# EAGLE design pcm2912a (EAGLE 7.6.0)
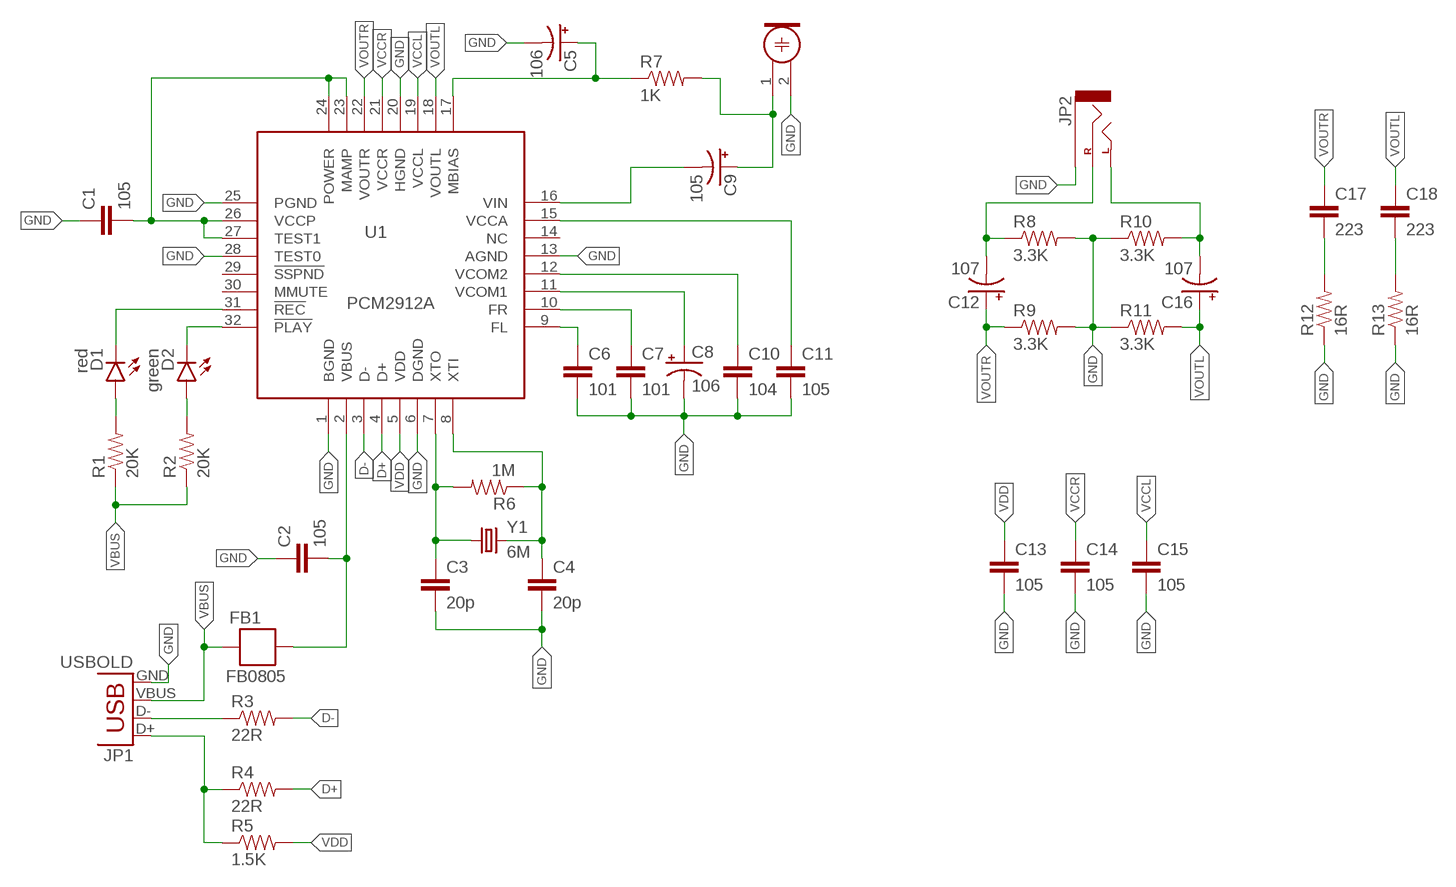
[diagram p0: schematic, sheet 1]

## Parts
C1  105  CAP0402-CAP  [0402-CAP]
C2  105  CAP0402-CAP  [0402-CAP]
C3  20p  CAP0402-CAP  [0402-CAP]
C4  20p  CAP0402-CAP  [0402-CAP]
C5  106  CAP_POL1206-KIT  [EIA3216-KIT]
C6  101  CAP0402-CAP  [0402-CAP]
C7  101  CAP0402-CAP  [0402-CAP]
C8  106  CAP_POL1206-KIT  [EIA3216-KIT]
C9  105  CAP_POL1206-KIT  [EIA3216-KIT]
C10  104  CAP0402-CAP  [0402-CAP]
C11  105  CAP0402-CAP  [0402-CAP]
C12  107  CAP_POL3528-KIT  [EIA3528-KIT]
C13  105  CAP0402-CAP  [0402-CAP]
C14  105  CAP0402-CAP  [0402-CAP]
C15  105  CAP0402-CAP  [0402-CAP]
C16  107  CAP_POL3528-KIT  [EIA3528-KIT]
C17  223  CAP0402-CAP  [0402-CAP]
C18  223  CAP0402-CAP  [0402-CAP]
D1  red  LED-EASY  [LED-0603-EASY]
D2  green  LED-EASY  [LED-0603-EASY]
FB1  FB0805  [0805]
JP1  USBOLD  [USB-MINIB-OLD]
JP2  AUDIO-JACKAUDIO-JACK-3.5MM-PTH-JLC  [AUDIO-JACK-3.5MM-PTH-JLC]
M1  ELECTRET_MICROPHON-WM-62PC/62PK  [WM-62PC/62PK]
R1  20K  RESISTOR0402  [0402-RES]
R2  20K  RESISTOR0402  [0402-RES]
R3  22R  RESISTOR0402  [0402-RES]
R4  22R  RESISTOR0402  [0402-RES]
R5  1.5K  RESISTOR0402  [0402-RES]
R6  1M  RESISTOR0402  [0402-RES]
R7  1K  RESISTOR0402  [0402-RES]
R8  3.3K  RESISTOR0402  [0402-RES]
R9  3.3K  RESISTOR0402  [0402-RES]
R10  3.3K  RESISTOR0402  [0402-RES]
R11  3.3K  RESISTOR0402  [0402-RES]
R12  16R  RESISTOR0402  [0402-RES]
R13  16R  RESISTOR0402  [0402-RES]
U1  PCM2912A  [TQFP32-08]
Y1  6M  CRYSTALHC49US  [HC49US]

## Nets
D+: R4.2 U1.4(D+)
D-: R3.2 U1.3(D-)
GND: C1.1 C2.1 C3.2 C4.2 C5.C(-) C6.2 C7.2 C8.C(-) C10.2 C11.2 C13.2 C14.2 C15.2 JP1.GND JP2.P$1(SLEEVE) M1.2 R8.2 R9.2 R10.1 R11.1 R12.1 R13.1 U1.1(BGND) U1.6(DGND) U1.13(AGND) U1.20(HGND) U1.25(PGND) U1.28(TEST0)
N$1: C6.1 U1.9(FL)
N$2: C7.1 U1.10(FR)
N$3: C8.A(+) U1.11(VCOM1)
N$4: C10.1 U1.12(VCOM2)
N$5: C11.1 U1.15(VCCA)
N$6: D1.-(C) U1.31(!REC)
N$7: D2.-(C) U1.32(!PLAY)
N$8: D1.+(A) R1.2
N$9: D2.+(A) R2.2
N$10: C3.1 R6.2 U1.7(XTO) Y1.1
N$11: C4.1 R6.1 U1.8(XTI) Y1.2
N$12: JP1.D- R3.1
N$13: JP1.D+ R4.1 R5.1
N$14: C9.C(-) U1.16(VIN)
N$15: C2.2 FB1.1 U1.2(VBUS)
N$16: C12.C(-) JP2.P$2(RIGHT) R8.1
N$17: C1.2 U1.23(MAMP) U1.24(POWER) U1.26(VCCP) U1.27(TEST1)
N$18: C9.A(+) M1.1 R7.2
N$19: C5.A(+) R7.1 U1.17(MBIAS)
N$21: C16.C(-) JP2.P$3(LEFT) R10.2
N$22: C17.2 R12.2
N$24: C18.2 R13.2
VBUS: FB1.2 JP1.VBUS R1.1 R2.1
VCCL: C15.1 U1.19(VCCL)
VCCR: C14.1 U1.21(VCCR)
VDD: C13.1 R5.2 U1.5(VDD)
VOUTL: C16.A(+) C18.1 R11.2 U1.18(VOUTL)
VOUTR: C12.A(+) C17.1 R9.1 U1.22(VOUTR)
Unconnected: U1.14(NC) U1.29(!SSPND) U1.30(MMUTE)

## Library data of the parts
C1-C4 C6 C7 C10 C11 C13-C15 C17 C18 = z_jlc_smt:CAP: Capacitor Standard 0603 ceramic capacitor, and 0.1" leaded capacitor.
C5 C8 C9 C12 C16 = z_jlc_smt:CAP_POL: Capacitor Polarized These are standard SMD and PTH capacitors. Normally 10uF, 47uF, and 100uF in electrolytic and tantalum varieties. Always verify the external diameter of the through hole cap, it varies with capacity, voltage, and manufacturer. The EIA devices should be standard.
D1 D2 = z_jlc_smt:LED: LEDs Standard schematic elements and footprints for 5mm, 3mm, 1206, and 0603 sized LEDs. 5mm - Spark Fun Electronics SKU : COM-00529 (and others)
FB1 = xmgu2008:FB
JP1 = xmgu2008:USB: USB Connectors USB-B-PTH is fully proven SKU : PRT-00139/CONN-08278 USB-miniB is fully proven SKU : PRT-00587 USB-A-PCB is untested. USB-A-H is throughly reviewed, but untested. Spark Fun Electronics SKU : PRT-00437 USB-B-SMT is throughly reviewed, but untested. Needs silkscreen touching up. USB-A-S has not been used/tested USB-MB-H has not been used/tested USB-MICROB has been used. CONN-09505
JP2 = xmgu2008:AUDIO-JACK: 3.5mm Audio Jack Simple 3.5mm common PCB mount audio jack. Variant PTH is our storefront SKU PRT-08032
M1 = xmgu2008:ELECTRET_MICROPHON-: Electret Condenser Microphone
R1-R13 = z_jlc_smt:RESISTOR: Resistor Basic schematic elements and footprints for 0603, 1206, and PTH resistors.
U1 = xmgu2008:PCM2912A
Y1 = xmgu2008:CRYSTAL: Various standard crystals. Proven footprints.

## Board
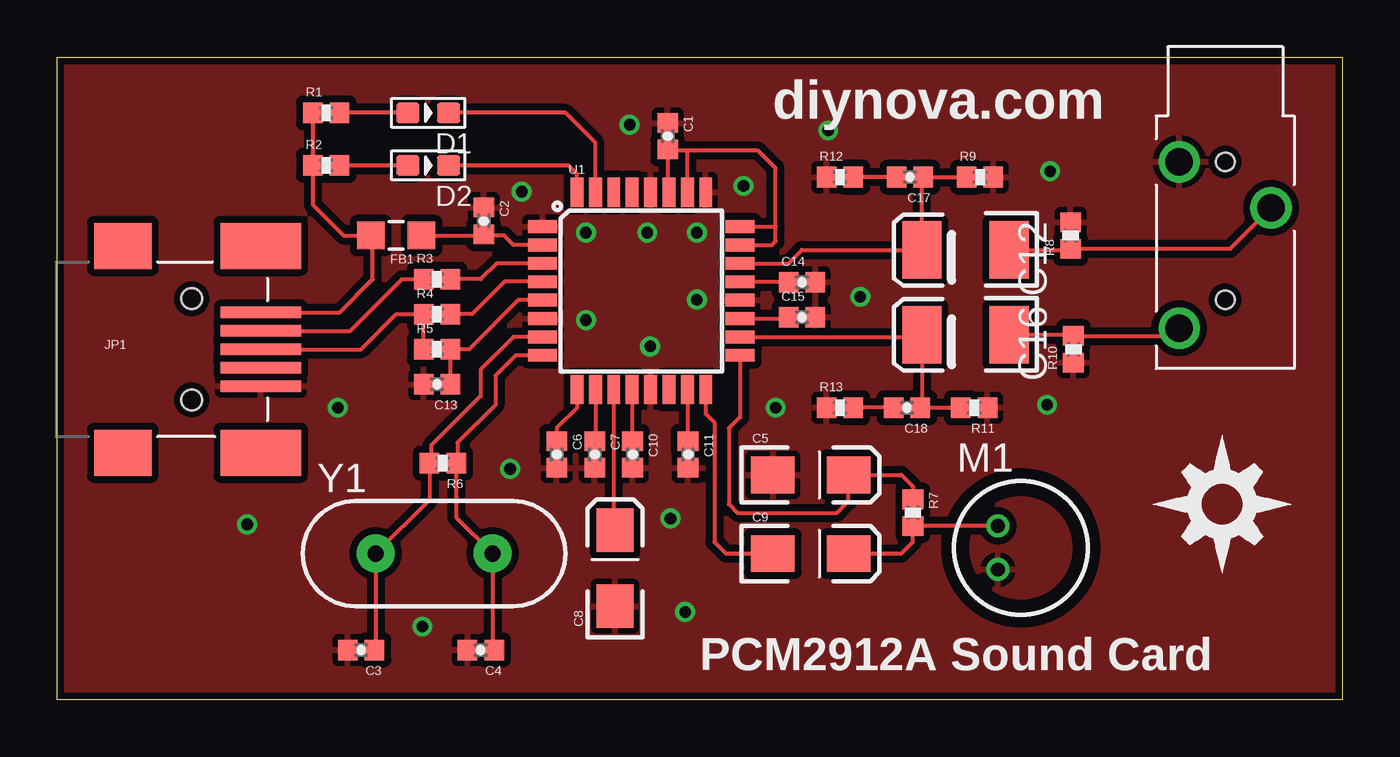
[diagram p1: board, top side]
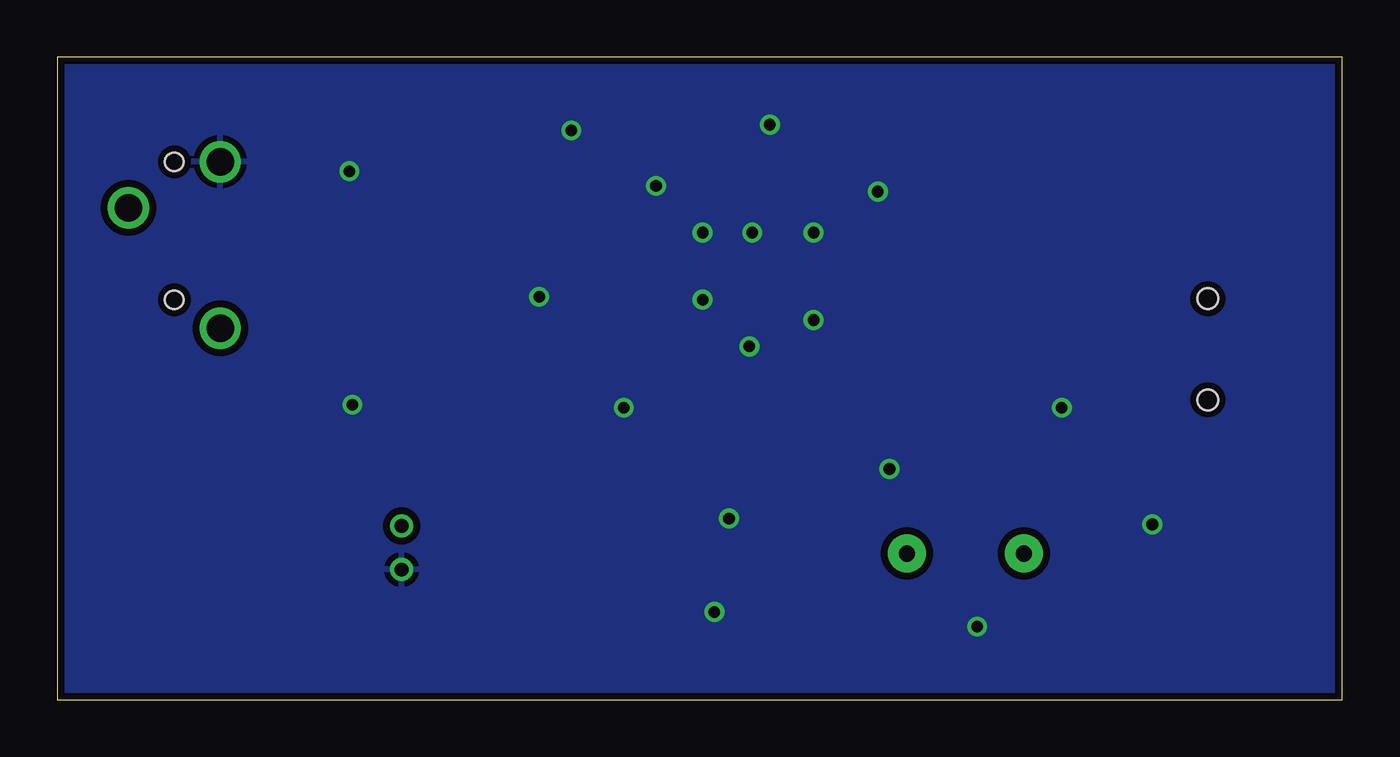
[diagram p2: board, bottom side, seen from below]

Size 55.88 x 27.94 mm. Coordinates in mm from the lower left corner, seen from the top.
Outline: 0,0 0,27.94 55.88,27.94 55.88,0 0,0
Copper layers (1*16): Top 0.035mm / dielectric 1.5mm / Bottom 0.035mm
Design rules "SparkFun-2-layer-TIGHT": minimum track width 7mil, minimum drill 15mil, track to track 7mil, track to pad 7mil, pad to pad 7mil, via to via 7mil, smd to smd 7mil, copper to edge 7mil, drill to drill 7mil, minimum pad ring 7mil, minimum via ring 7mil, stop-mask expansion 4mil, vias tented up to drill 20mil, thermal gap 10mil

### Footprints (pad centres in the part's own frame; a part is rotated, then mirrored left to right if it is on the bottom)
0402-CAP = smd 0.85 x 0.9: 1 -0.58,0; 2 0.58,0
EIA3216-KIT = smd 1.9 x 1.6: A 1.65,0; C -1.65,0
EIA3528-KIT = smd 1.7 x 2.5: A 1.9,0; C -1.9,0
LED-0603-EASY = smd 1.016 x 0.889: + 0.889,0; - -0.889,0
0805 = smd 1.2 x 1.2: 1 -1.1,0; 2 1.1,0
USB-MINIB-OLD = smd 2.5 x 2: 1 -3,-4.5; 2 -3,4.5 | smd 3.5 x 2: 3 3,-4.5; 4 3,4.5 | smd 3.5 x 0.5: D+ 3,0; D- 3,0.8; GND 3,-1.6; ID 3,-0.8; VBUS 3.01,1.61 | hole 0.9: 0,2.2; 0,-2.2
AUDIO-JACK-3.5MM-PTH-JLC = drill 1.2: P$1 2,-2; P$2 4,2; P$3 9.25,-2 | hole 0.8: 2,0; 8,0
WM-62PC/62PK = drill 0.6 pad 1: 1 -1,0.95; 2 -1,-0.95
0402-RES = smd 0.85 x 0.9: 1 -0.58,0; 2 0.58,0
TQFP32-08 = smd 1.27 x 0.559: 1 -4.293,2.8; 2 -4.293,2; 3 -4.293,1.2; 4 -4.293,0.4; 5 -4.293,-0.4; 6 -4.293,-1.2; 7 -4.293,-2; 8 -4.293,-2.8; 17 4.293,-2.8; 18 4.293,-2; 19 4.293,-1.2; 20 4.293,-0.4; 21 4.293,0.4; 22 4.293,1.2; 23 4.293,2; 24 4.293,2.8 | smd 0.559 x 1.27: 9 -2.8,-4.293; 10 -2,-4.293; 11 -1.2,-4.293; 12 -0.4,-4.293; 13 0.4,-4.293; 14 1.2,-4.293; 15 2,-4.293; 16 2.8,-4.293; 25 2.8,4.293; 26 2,4.293; 27 1.2,4.293; 28 0.4,4.293; 29 -0.4,4.293; 30 -1.2,4.293; 31 -2,4.293; 32 -2.8,4.293
HC49US = drill 0.7 pad 1.651: 1 -2.54,0; 2 2.54,0

### Placement (x,y rotation side)
C1  26.54,24.51 270 top
C2  18.54,20.83 270 top
C3  13.21,2.16 180 top
C4  18.41,2.16 180 top
C5  32.77,9.78 0 top
C6  21.72,10.67 270 top
C7  23.37,10.67 270 top
C8  24.26,5.71 90 top
C9  32.77,6.35 0 top
C10  25.02,10.67 270 top
C11  27.43,10.67 270 top
C12  39.5,19.56 180 top
C13  16.51,13.72 180 top
C14  32.38,18.16 0 top
C15  32.38,16.64 0 top
C16  39.5,15.88 180 top
C17  37.08,22.73 180 top
C18  36.96,12.7 180 top
D1  16.13,25.53 180 top
D2  16.13,23.24 180 top
FB1  14.73,20.19 180 top
JP1  5.84,15.24 0 top
JP2  50.8,25.4 270 top
M1  41.91,6.6 0 top
R1  11.68,25.53 0 top
R2  11.68,23.24 0 top
R3  16.51,18.29 0 top
R4  16.51,16.76 0 top
R5  16.51,15.24 0 top
R6  16.76,10.29 180 top
R7  37.21,8.13 270 top
R8  44.07,20.19 90 top
R9  40.13,22.73 0 top
R10  44.2,15.24 90 top
R11  39.88,12.7 180 top
R12  34.04,22.73 0 top
R13  34.04,12.7 0 top
U1  25.4,17.78 0 top
U$1  [DIYNOVA_LOGO]  47.62,5.46 0 top
Y1  16.38,6.35 0 top

### Tracks (layer width: path | path; a pad name or v marks a point on that pad's centre or on a via)
D+
  Top 0.178: U1.4 19.45,18.18 18.03,16.76 R4.2
D-
  Top 0.178: U1.3 19.11,18.98 18.41,18.29 R3.2
GND  (via drill 0.51)
  other vias: 8.26,7.62 12.19,12.7 20.19,22.1 24.89,25.02 33.53,24.77 43.18,22.99 43.05,12.83 34.92,17.53 27.81,17.4 25.78,15.37 22.99,16.51 22.99,20.32 27.81,20.32 29.84,22.35 25.65,20.32 31.24,12.7 27.3,3.81 15.88,3.17 19.68,10.03 26.67,7.87
  pour Top (isolate 0.305): 0,0 0,27.94 55.88,27.94 55.88,0
  pour Bottom (isolate 0.305): 0,0 0,27.94 55.88,27.94 55.88,0
N$1
  Top 0.178: U1.9 22.6,12.69 21.72,11.81 C6.1
N$2
  Top 0.178: U1.10 23.4,11.28 C7.1
N$3
  Top 0.178: U1.11 24.2,7.42 C8.A
N$4
  Top 0.178: U1.12 25,11.27 C10.1
N$5
  Top 0.178: U1.15 27.4,11.28 C11.1
N$6
  Top 0.178: U1.31 23.4,24.23 22.1,25.53 D1.-
N$7
  Top 0.178: U1.32 22.6,22.87 22.23,23.24 D2.-
N$8
  Top 0.178: D1.+ R1.2
N$9
  Top 0.178: D2.+ R2.2
N$10
  Top 0.178: U1.7 19.84,15.78 18.41,14.35 18.41,13.21 16.26,11.05 16.26,10.36 R6.2 16.18,8.69 Y1.1 13.84,2.21 C3.1
N$11
  Top 0.178: U1.8 19.93,14.98 19.05,14.1 19.05,12.83 17.4,11.18 17.4,10.34 R6.1 17.34,7.93 Y1.2 18.92,2.23 C4.1
N$12
  Top 0.178: JP1.D- 12.74,16.04 14.99,18.29 R3.1
N$13
  Top 0.178: JP1.D+ 13.21,15.24 14.73,16.76 R4.1 R5.1
N$14
  Top 0.178: U1.16 28.2,12.44 28.57,12.06 28.57,6.86 29.08,6.35 C9.C
N$15
  Top 0.178: U1.2 19.84,19.78 19.43,20.19 18.6,20.19 C2.2 18.49,20.19 FB1.1
N$16
  Top 0.178: C12.C 44.01,19.56 R8.1 51.01,19.61 JP2.P$2
N$17
  Top 0.178: U1.27 26.54,22.13 C1.2 26.6,23.88 27.43,23.88 | U1.23 31.08,19.78 31.24,19.94 31.24,20.57 | U1.24 31.24,20.58 31.24,20.57 | 31.24,20.57 31.24,23.11 30.48,23.88 27.43,23.88 | U1.26 27.4,23.84 27.43,23.88
N$18
  Top 0.178: M1.1 R7.2 37.21,6.86 36.7,6.35 C9.A
N$19
  Top 0.178: R7.1 37.21,9.27 36.7,9.78 C5.A 34.42,8.64 33.91,8.13 29.59,8.13 29.21,8.51 29.21,11.81 29.69,12.29 U1.17
N$21
  Top 0.178: C16.C 44.14,15.88 R10.2 48.47,15.82 JP2.P$3
N$22
  Top 0.178: C17.2 R12.2
N$24
  Top 0.178: C18.2 R13.2
VBUS
  Top 0.178: JP1.VBUS 12.28,16.85 13.72,18.29 13.72,20.11 FB1.2 12.45,20.19 11.1,21.54 R2.1 R1.1
VCCL
  Top 0.178: U1.19 31.75,16.58 C15.1
VCCR
  Top 0.178: U1.21 31.79,18.18 C14.1
VDD
  Top 0.178: U1.5 20.05,17.38 17.91,15.24 R5.2 C13.1
VOUTL
  Top 0.178: U1.18 37.5,15.78 C16.A 37.6,12.76 C18.1 R11.2
VOUTR
  Top 0.178: U1.22 31.81,18.98 32.38,19.56 C12.A 37.6,22.67 C17.1 R9.1

### Text on the board
tPlace: diynova.com | PCM2912A Sound Card